# EAGLE design 0101 (EAGLE 9.6.2)
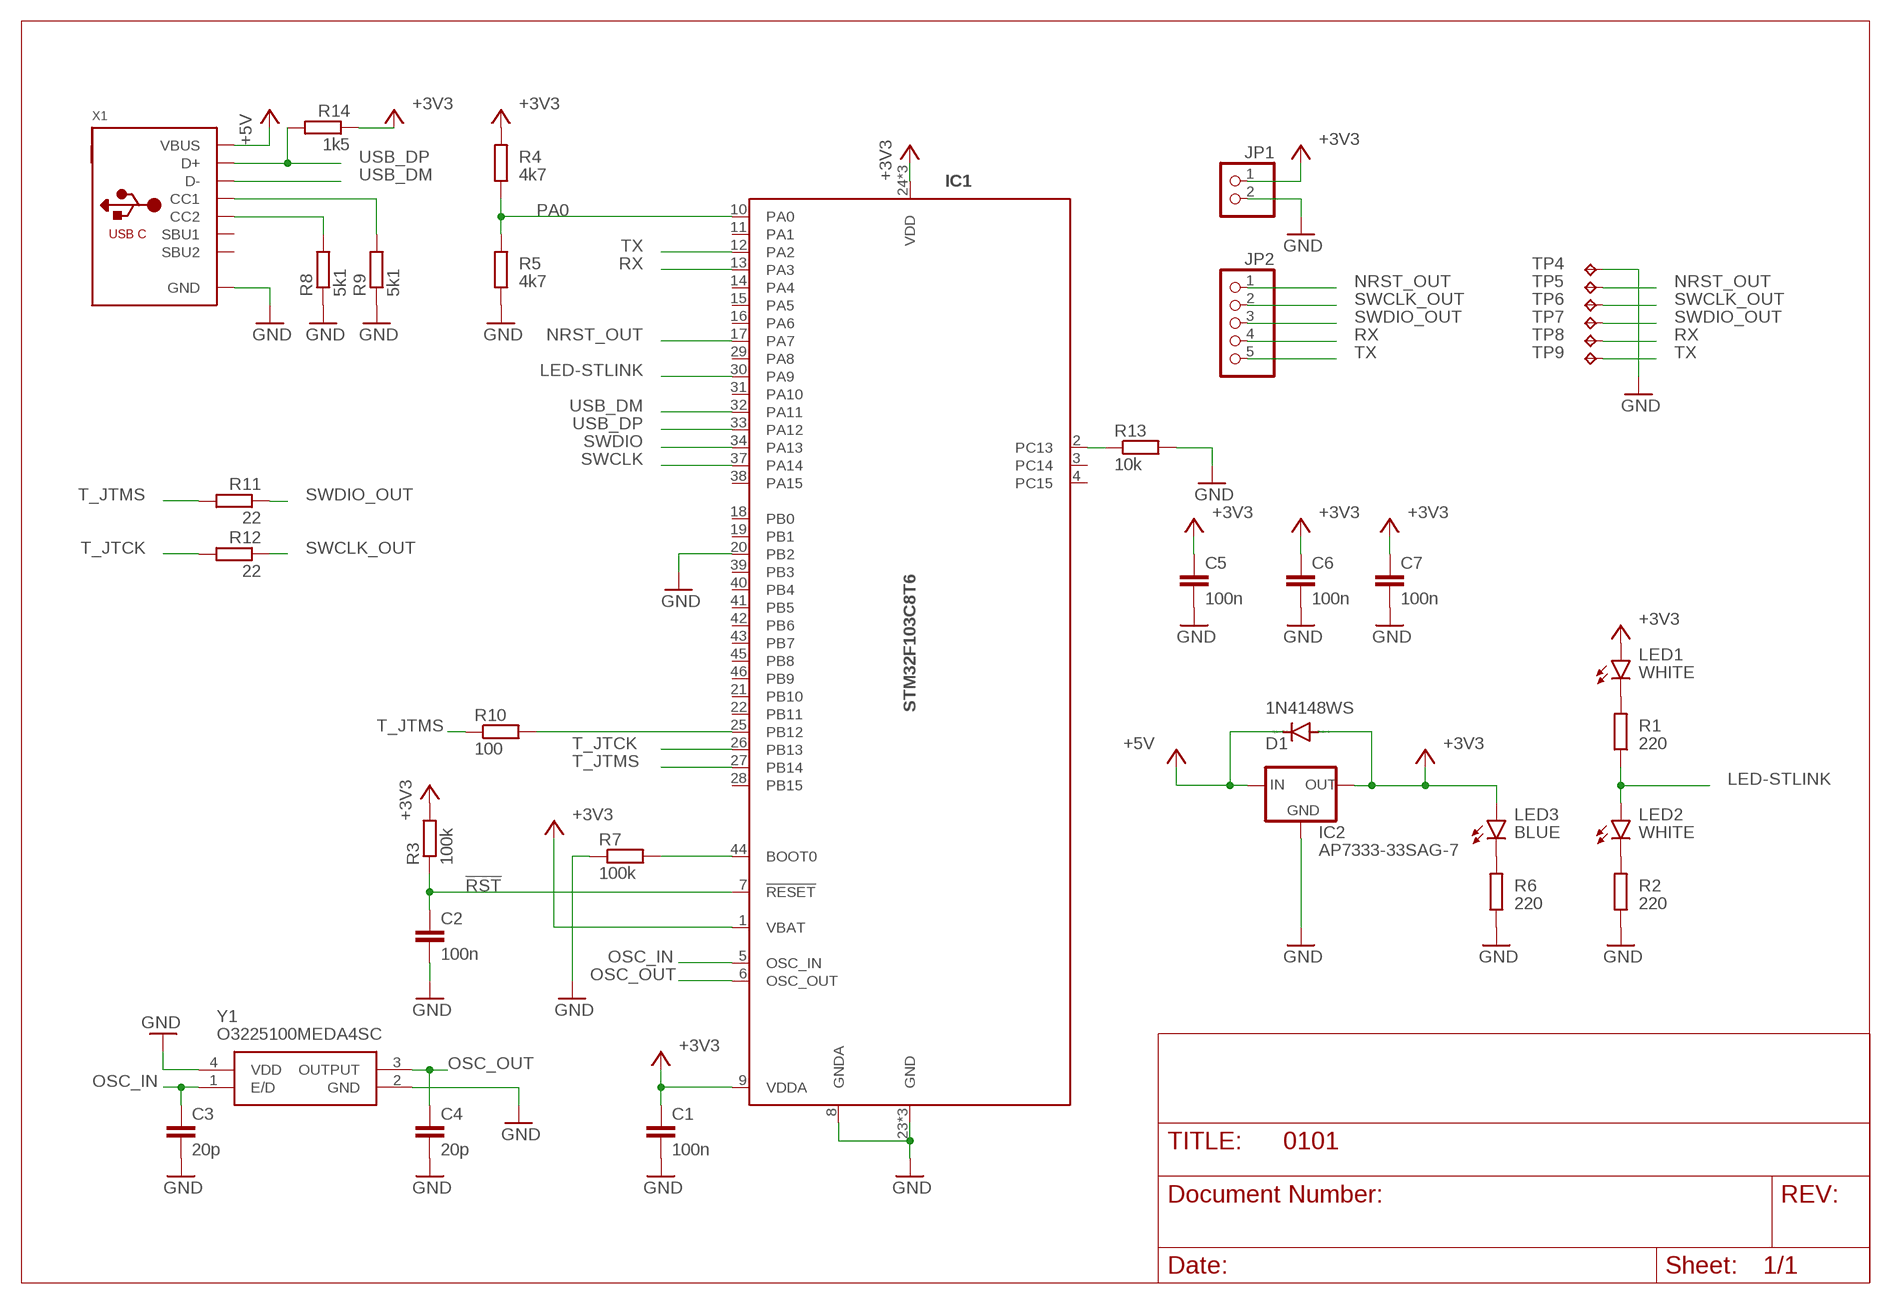
[diagram p0: schematic, sheet 1]

## Parts
C1  100n  C-EUC0402  [C0402]
C2  100n  C-EUC0402  [C0402]
C3  20p  C-EUC0402  [C0402]
C4  20p  C-EUC0402  [C0402]
C5  100n  C-EUC0402  [C0402]
C6  100n  C-EUC0402  [C0402]
C7  100n  C-EUC0402  [C0402]
D1  1N4148WS  DIODE-SOD323-R  [SOD323-R]
IC1  STM32F103C8T6  [QFP48-7X7-0.5]
IC2  AP7333-33SAG-7  XC63FPM  [SOT23]
JP1  PINHD-1X2  [1X02]
JP2  PINHD-1X5  [1X05]
LED1  WHITE  LEDCHIP-LED0603  [CHIP-LED0603]
LED2  WHITE  LEDCHIP-LED0603  [CHIP-LED0603]
LED3  BLUE  LEDCHIP-LED0603  [CHIP-LED0603]
R1  220  R-EU_R0402  [R0402]
R2  220  R-EU_R0402  [R0402]
R3  100k  R-EU_R0402  [R0402]
R4  4k7  R-EU_R0402  [R0402]
R5  4k7  R-EU_R0402  [R0402]
R6  220  R-EU_R0402  [R0402]
R7  100k  R-EU_R0402  [R0402]
R8  5k1  R-EU_R0402  [R0402]
R9  5k1  R-EU_R0402  [R0402]
R10  100  R-EU_R0402  [R0402]
R11  22  R-EU_R0402  [R0402]
R12  22  R-EU_R0402  [R0402]
R13  10k  R-EU_R0402  [R0402]
R14  1k5  R-EU_R0402  [R0402]
TP4  TPTP10SQ  [TP10SQ]
TP5  TPTP10R  [TP10R]
TP6  TPTP10R  [TP10R]
TP7  TPTP10R  [TP10R]
TP8  TPTP10R  [TP10R]
TP9  TPTP10R  [TP10R]
X1  USB_C  [USB_C_CUSB31-CFM2AX-01-X]
Y1  O3225100MEDA4SC  [O3225100MEDA4SC]

## Nets
!RST: C2.1 IC1.7(!RESET) R3.1
+3V3 [PWR]: C1.1 C5.1 C6.1 C7.1 D1.A IC1.1(VBAT) IC1.9(VDDA) IC1.24(VDD) IC1.36(VDD) IC1.48(VDD) IC2.2(OUT) JP1.1 LED1.A LED3.A R3.2 R4.2 R14.1
+5V [PWR]: D1.C IC2.3(IN) X1.A4B9(VBUS) X1.B4A9(VBUS)
GND [PWR]: C1.2 C2.2 C3.2 C4.2 C5.2 C6.2 C7.2 IC1.8(GNDA) IC1.20(PB2) IC1.23(GND) IC1.35(GND) IC1.47(GND) IC2.1(GND) JP1.2 R2.1 R5.1 R6.1 R7.1 R8.1 R9.1 R13.2 TP4.TP X1.A1B12(GND) X1.B1A12(GND) Y1.2(GND) Y1.4(VDD)
LED-STLINK: IC1.30(PA9) LED2.A R1.1
N$1: IC1.2(PC13) R13.1
N$2: LED2.C R2.2
N$3: LED3.C R6.2
N$4: IC1.44(BOOT0) R7.2
N$5: LED1.C R1.2
N$6: R9.2 X1.A5(CC1)
N$7: R8.2 X1.B5(CC2)
N$8: IC1.25(PB12) R10.2
NRST_OUT: IC1.17(PA7) JP2.1 TP5.TP
OSC_IN: C3.1 IC1.5(OSC_IN) Y1.1(E/D)
OSC_OUT: C4.1 IC1.6(OSC_OUT) Y1.3(OUTPUT)
PA0: IC1.10(PA0) R4.1 R5.2
RX: IC1.13(PA3) JP2.4 TP8.TP
SWCLK: IC1.37(PA14)
SWCLK_OUT: JP2.2 R12.1 TP6.TP
SWDIO: IC1.34(PA13)
SWDIO_OUT: JP2.3 R11.1 TP7.TP
T_JTCK: IC1.26(PB13) R12.2
T_JTMS: IC1.27(PB14) R10.1 R11.2
TX: IC1.12(PA2) JP2.5 TP9.TP
USB_DM: IC1.32(PA11) X1.A7(D-) X1.B7(D-)
USB_DP: IC1.33(PA12) R14.2 X1.A6(D+) X1.B6(D+)
Unconnected: IC1.3(PC14) IC1.4(PC15) IC1.11(PA1) IC1.14(PA4) IC1.15(PA5) IC1.16(PA6) IC1.18(PB0) IC1.19(PB1) IC1.21(PB10) IC1.22(PB11) IC1.28(PB15) IC1.29(PA8) IC1.31(PA10) IC1.38(PA15) IC1.39(PB3) IC1.40(PB4) IC1.41(PB5) IC1.42(PB6) IC1.43(PB7) IC1.45(PB8) IC1.46(PB9) X1.A8(SBU1) X1.B8(SBU2)

## Library data of the parts
C1-C7 = rcl:C-EU: CAPACITOR, European symbol; SPICEPREFIX: C
D1 = diode:DIODE-: DIODE
IC1 = STM32F10x:STM32F103C; MF: ST; MPN: STM32F103C8T6
IC2 = v-reg:XC63FP: Positiv Voltage Regulators www.torex.co.jp/english/product/pro02/pdf/0201_xc62fp.pdf
JP1 = pinhead-compact:PINHD-1X2: PIN HEADER
JP2 = pinhead-compact:PINHD-1X5: PIN HEADER
LED1-LED3 = led:LED: LED OSRAM: - CHIPLED LG R971, LG N971, LY N971, LG Q971, LY Q971, LO R971, LY R971 LH N974, LH R974 LS Q976, LO Q976, LY Q976 LO Q996 - Hyper CHIPLED LW Q18S LB Q993, LB Q99A, LB R99A - SideLED LS A670, LO A670, LY A670, LG A670, LP A670 LB A673, LV A673, LT A673, LW A673 LH A674 LY A675 LS A676, LA A676, LO A676, LY A676, LW A676 LS A679, LY A679, LG A679 - Hyper Micro SIDELED® LS Y876, LA Y876, LO Y876, LY Y876 LT Y87S - SmartLED LW L88C, LW L88S LB L89C, LB L89S, LG L890 LS L89K, LO L89K, LY L89K LS L896, LA L896, LO L896, LY L896 - TOPLED LS T670, LO T670, LY T670, LG T670, LP T670 LSG T670, LSP T670, LSY T670, LOP T670, LYG T670 LG T671, LOG T671, LSG T671 LB T673, LV T673, LT T673, LW T673 LH T674 LS T676, LA T676, LO T676, LY T676, LB T676, LH T676, LSB T676, LW T676 LB T67C, LV T67C, LT T67C, LS T67K, LO T67K, LY T67K, LW E67C LS E67B, LA E67B, LO E67B, LY E67B, LB E67C, LV E67C, LT E67C LW T67C LS T679, LY T679, LG T679 LS T770, LO T770, LY T770, LG T770, LP T770 LB T773, LV T773, LT T773, LW T773 LH T774 LS E675, LA E675, LY E675, LS T675 LS T776, LA T776, LO T776, LY T776, LB T776 LHGB T686 LT T68C, LB T68C - Hyper Mini TOPLED® LB M676 - Mini TOPLED Santana® LG M470 LS M47K, LO M47K, LY M47K Source: http://www.osram.convergy.de LUXEON: - LUMILED® LXK2-PW12-R00, LXK2-PW12-S00, LXK2-PW14-U00, LXK2-PW14-V00 LXK2-PM12-R00, LXK2-PM12-S00, LXK2-PM14-U00 LXK2-PE12-Q00, LXK2-PE12-R00, LXK2-PE12-S00, LXK2-PE14-T00, LXK2-PE14-U00 LXK2-PB12-K00, LXK2-PB12-L00, LXK2-PB12-M00, LXK2-PB14-N00, LXK2-PB14-P00, LXK2-PB14-Q00 LXK2-PR12-L00, LXK2-PR12-M00, LXK2-PR14-Q00, LXK2-PR14-R00 LXK2-PD12-Q00, LXK2-PD12-R00, LXK2-PD12-S00 LXK2-PH12-R00, LXK2-PH12-S00 LXK2-PL12-P00, LXK2-PL12-Q00, LXK2-PL12-R00 Source: www.luxeon.com KINGBRIGHT: KA-3528ASYC Source: www.kingbright.com
R1-R14 = rcl:R-EU_: RESISTOR, European symbol; SPICEPREFIX: R
TP4-TP9 = testpad:TP: Test pad
X1 = microbuilder:USB_C: USB Type-C USB 2.0 Connector
Y1 = 7325-0800A2010-00:O3225100MEDA4SC: SMD Oscillators(XO) 100MHz +/-20ppm SMD-3225_4P RoHS Source: Datasheet <https://datasheet.lcsc.com/szlcsc/Yangxing-Tech-O3225100MEDA4SC_C70602.pdf>; DESCRIPTION: SMD Oscillators(XO) 100MHz +/-20ppm SMD-3225_4P RoHS; HEIGHT: 1.1mm; MANUFACTURER_NAME: Yangxing Tech; MANUFACTURER_PART_NUMBER: O3225100MEDA4SC

## Net classes
0 default: width 0.254 mm
1 PWR: width 0.254 mm

## Board
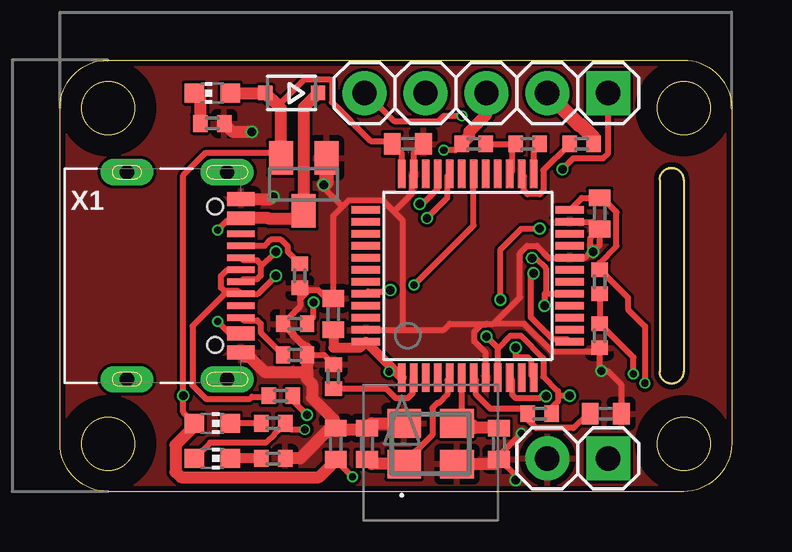
[diagram p1: board, top side]
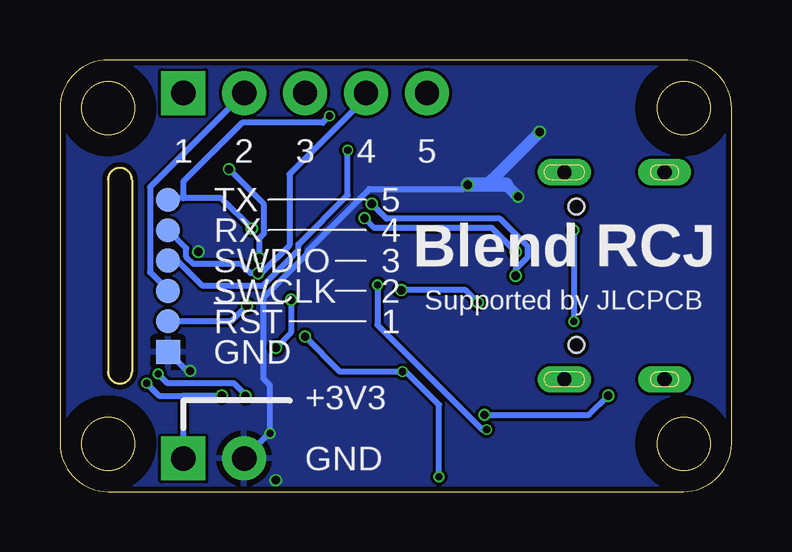
[diagram p2: board, bottom side, seen from below]

Size 28 x 18 mm. Coordinates in mm from the lower left corner, seen from the top.
Outline: 2,18 26,18 arc-90 28,16 28,2 arc-90 26,0 2,0 arc-90 0,2 0,16 arc-90 2,18
Outline: 25,13 25,5 arc180 26,5 26,13 arc180 25,13
Outline: circle at 2,16 radius 1.1
Outline: circle at 2,2 radius 1.1
Outline: circle at 26,2 radius 1.1
Outline: circle at 26,16 radius 1.1
Copper layers (1*16): Top 0.035mm / dielectric 1.6mm / Bottom 0.035mm
Design rules "jlcpcb-2layers": minimum track width 5mil, minimum drill 0.3mm, track to track 5mil, track to pad 5mil, pad to pad 5mil, via to via 5mil, smd to smd 5mil, copper to edge 0.2mm, drill to drill 6mil, minimum pad ring 10mil, minimum via ring 3mil, stop-mask expansion 4mil, vias tented up to drill 0mil, thermal gap 10mil
tRestrict: area 24,0 to 28,4; area 24,14 to 28,18; area 0,0 to 4,4; area 0,14 to 4,18
bRestrict: area 24,14 to 28,18; area 24,0 to 28,4; area 0,0 to 4,4; area 0,14 to 4,18

### Footprints (pad centres in the part's own frame; a part is rotated, then mirrored left to right if it is on the bottom)
C0402 = smd 0.7 x 0.9: 1 -0.65,0; 2 0.65,0
SOD323-R = smd 0.6 x 0.6: A 1.1,0; C -1.1,0
QFP48-7X7-0.5 = smd 1.2 x 0.3: 1 -4.25,2.75; 2 -4.25,2.25; 3 -4.25,1.75; 4 -4.25,1.25; 5 -4.25,0.75; 6 -4.25,0.25; 7 -4.25,-0.25; 8 -4.25,-0.75; 9 -4.25,-1.25; 10 -4.25,-1.75; 11 -4.25,-2.25; 12 -4.25,-2.75; 25 4.25,-2.75; 26 4.25,-2.25; 27 4.25,-1.75; 28 4.25,-1.25; 29 4.25,-0.75; 30 4.25,-0.25; 31 4.25,0.25; 32 4.25,0.75; 33 4.25,1.25; 34 4.25,1.75; 35 4.25,2.25; 36 4.25,2.75 | smd 0.3 x 1.2: 13 -2.75,-4.25; 14 -2.25,-4.25; 15 -1.75,-4.25; 16 -1.25,-4.25; 17 -0.75,-4.25; 18 -0.25,-4.25; 19 0.25,-4.25; 20 0.75,-4.25; 21 1.25,-4.25; 22 1.75,-4.25; 23 2.25,-4.25; 24 2.75,-4.25; 37 2.75,4.25; 38 2.25,4.25; 39 1.75,4.25; 40 1.25,4.25; 41 0.75,4.25; 42 0.25,4.25; 43 -0.25,4.25; 44 -0.75,4.25; 45 -1.25,4.25; 46 -1.75,4.25; 47 -2.25,4.25; 48 -2.75,4.25
SOT23 = smd 1 x 1.4: 1 -0.95,-1.1; 2 0.95,-1.1; 3 0,1.1
1X02 = drill 1.016 square: 1 -1.27,0 | drill 1.016: 2 1.27,0
1X05 = drill 1.016 square: 1 -5.08,0 | drill 1.016: 2 -2.54,0; 3 0,0; 4 2.54,0; 5 5.08,0
CHIP-LED0603 = smd 0.8 x 0.8: A 0,-0.75; C 0,0.75
R0402 = smd 0.6 x 0.7: 1 -0.5,0; 2 0.5,0
TP10SQ = smd 1 x 1: TP 0,0
TP10R = smd 1 x 1: TP 0,0
USB_C_CUSB31-CFM2AX-01-X = smd 0.575 x 1.15: A1B12 -3.2,3.545; A4B9 -2.4,3.545; B1A12 3.2,3.545; B4A9 2.4,3.545 | smd 0.275 x 1.15: A5 -1.25,3.545; A6 -0.25,3.545; A7 0.25,3.545; A8 1.25,3.545; B5 1.75,3.545; B6 0.75,3.545; B7 -0.75,3.545; B8 -1.75,3.545 | drill 0.6 pad 1 long: M1 -4.32,2.97; M2 4.32,2.97; M3 -4.32,-1.21; M4 4.32,-1.21 | hole 0.65: 2.89,2.47; -2.89,2.47
O3225100MEDA4SC = smd 1.4 x 1.2: 1 -1.1,-0.85; 2 1.1,-0.85; 3 1.1,0.85; 4 -1.1,0.85

### Placement (x,y rotation side)
C1  11.5,2 90 top
C2  22.75,3.25 0 top
C3  12.8,2 90 top
C4  18.3,2 270 top
C5  11.4,7.4 90 top
C6  14.5,14.5 0 top
C7  22.5,11.6 270 top
D1  9.66,16.62 180 top
IC1  17,9 90 top
IC2  10.16,12.81 180 top
JP1  21.59,1.38 180 top
JP2  17.78,16.62 180 top
LED1  6.35,2.85 270 top
LED2  6.35,1.38 270 top
LED3  6.35,16.62 90 top
R1  8.89,2.85 180 top
R2  8.89,1.38 180 top
R3  20,3.25 0 top
R4  22.5,8.75 90 top
R5  22.5,6.5 90 top
R6  6.35,15.35 180 top
R7  9.8,7 0 top
R8  9.8,5.7 180 top
R9  10,9 90 top
R10  19.5,14.5 0 top
R11  17.25,14.5 0 top
R12  21.75,14.5 180 top
R13  11.4,4.8 90 top
R14  9.2,4 180 top
TP4  23.5,5.83 90 bottom
TP5  23.5,7.09 90 bottom
TP6  23.5,8.37 90 bottom
TP7  23.5,9.63 90 bottom
TP8  23.5,10.9 90 bottom
TP9  23.5,12.18 90 bottom
X1  4,9 270 top
Y1  15.45,2 0 top

### Tracks (layer width: path | path; a pad name or v marks a point on that pad's centre or on a via)
!RST
  Top 0.254: C2.1 22.01,3.25 21.41,2.65 19.84,2.65 19.5,2.99 R3.1 19.3,3.45 17.94,3.45 17.58,3.81 17.35,4.04 17.35,4.65 IC1.7
+3V3  (via drill 0.3, 0.35)
  Top 0.254: IC1.36 14.25,14.1 C6.1 13.81,14.62 12.95,14.62 11.34,16.24 11.34,17.1 11.24,17.19 10.19,17.19 9.09,16.09 | IC1.24 21.75,12.25 C7.1 22.61,12.25 23.2,11.65 23.2,10.25 22.5,9.54 R4.2 22.57,9.19 23.68,8.09 23.68,7.6 24.39,6.89 v24.39,4.52 | 20.77,4 20.77,4.19 20.15,4.8 20.15,5.56 19.21,6.5 18.79,6.5 18.25,5.96 | 20.77,4 20.77,3.77 20.5,3.5 R3.2 | v21.25,4 20.77,4 | v13.72,5 13.86,5.14 | v12.19,0.62 11.62,1.19 C1.1 | IC1.9 18.25,5.96 | LED1.A 5.14,3.31 v5.14,4 5.14,13.19 6.08,14.13 8.99,14.13 IC2.2 | R14.1 9.7,3.8 v10.3,3.2 | v17.78,6.46 18.25,5.99 18.25,5.96
  Top 0.406: C5.1 11.4,6 12.5,6 IC1.48 13.86,5.14 IC1.1
  Top 0.508: LED3.A D1.A 9.09,16.09 9.21,15.97 IC2.2 | LED1.A 5.6,2.72 4.82,1.94 4.82,0.82 5.04,0.6 10.8,0.6 11.5,1.3 C1.1
  Bottom 0.254: v12.19,0.62 12.19,3.62 13.57,5 v13.72,5 16.32,5 v17.78,6.46 | v10.3,3.2 5.94,3.2 v5.14,4 | JP1.1 22.86,4 v21.25,4 23.87,4 v24.39,4.52
+5V  (via drill 0.3)
  Top 0.254: v6.57,7.09 7.05,6.62 7.53,6.62 X1.B4A9 | v6.57,10.9 6.95,11.29 7.33,11.29 X1.A4B9
  Top 0.508: D1.C 10.16,16.02 IC2.3 9.82,11.37 8.73,11.37 8.7,11.4 X1.A4B9
  Bottom 0.254: v6.57,10.9 6.57,8.43 v6.57,7.09
GND  (via drill 0.3, 0.35)
  Top 0.254: C6.2 14.75,14.1 IC1.35 14.67,13.19 14.67,12.43 13.92,11.69 | IC1.23 22.2,11.25 C7.2 | C7.2 22.1,10.55 22.1,9.99 21.86,9.75 IC1.20 20.38,9.75 19.89,10.24 19.48,10.24 19.18,9.94 19.18,8.1 18.08,7 | R7.1 9.75,7.45 9.75,7.46 10,7.71 10,8 | R9.1 10,8 | R5.1 22.5,5.83 | C2.2 23.4,4.46 22.84,5.03 v22.57,5.03 22.5,5.1 22.5,5.83 | IC1.47 14.28,6.75 | 14.28,6.75 16,6.75 16.25,7 17.8,7 | 10,8 10.07,8.07 10.07,8.1 10.36,8.39 10.78,8.39 11.17,8 11.35,8 C5.2 11.4,11.51 11.78,11.89 | R8.1 11,5.7 R13.2 | 11.78,11.89 12.04,12.15 13.46,12.15 13.92,11.69 | 14.28,6.75 14.28,11.33 13.92,11.69 | v19.24,2.43 18.38,1.57 C4.2 19,0.65 v19,0.48 | 11.78,11.89 11.14,12.52 v11,12.8 | C7.2 22.5,10.27 v22.23,10 | 17.8,7 18.08,7 | 18.08,7 19.35,7 20.51,5.85 22.48,5.85 22.5,5.83 | 17.8,7 17.77,6.96 17.57,6.96 17.27,6.67 17.27,6.25 17.75,5.78 IC1.8
  Top 0.305: R7.1 9.72,6.58 9.72,6.53 9.88,6.37 9.89,6.37 10.3,5.96
  Top 0.508: 11.43,2.58 12.72,2.58 C3.2 13,2.85 Y1.4 | Y1.2 18.1,1.15 C4.2 | 10.3,5.96 R8.1 | R8.1 10.3,4.97 8.56,4.97 7.91,5.62 7.73,5.62 X1.B1A12 | X1.A1B12 8.8,12.2 v8.9,12.3 | v8,15 7.2,15 R6.1 | R8.1 10.3,4.7 10.51,4.49 10.51,3.91 11.43,2.99 11.43,2.58 | 11.43,2.58 C1.2 11.27,2.65 10,1.38 R2.1
  Top 0.61: IC2.1 11.11,12.91 v11,12.8
  Bottom 0.254: v11,12.8 11.18,12.62 15.1,12.62 17.67,10.04 17.67,9.93 19.5,8.09 19.5,4.69 19.24,4.43 v19.24,2.43 19.27,2.43 JP1.2 | TP4.TP 22.7,5.03 v22.57,5.03
  Bottom 0.508: v8.9,12.3 9.4,12.8 | 9.8,12.8 10,13 v8,15
  Bottom 0.61: v11,12.8 9.8,12.8 9.4,12.8
  pour Top: 0,18 28,18 28,0 0,0
  pour Bottom: 0,18 28,18 28,0 0,0
LED-STLINK  (via drill 0.3)
  Top 0.254: v14.76,8.62 17.24,11.1 17.24,13.19 IC1.30 | v10.21,2.58 9.65,2.58 R1.1 8.94,2.4 8.94,2.39 8.58,2.03 6.25,2.03 LED2.A
  Bottom 0.254: v10.21,2.58 10.4,2.58 14.76,6.95 v14.76,8.62
N$1
  Top 0.254: IC1.2 14.71,4.71 14.71,4.1 14.51,3.9 13.99,3.9 13.59,4.3 R13.1
N$2
  Top 0.406: R2.2 LED2.C
N$3
  Top 0.508: LED3.C 5.85,16.37 R6.2
N$4  (via drill 0.35)
  Top 0.254: R7.2 10.57,7.27 v10.57,7.89 | IC1.44 12.85,8.35 13.77,8.35 v13.77,8.4
  Bottom 0.254: v10.57,7.89 11.09,8.4 v13.77,8.4
N$5
  Top 0.254: R1.2 LED1.C
N$6
  Top 0.254: R9.2 9.51,9.99 9.51,10.21 9.21,10.5 8.79,10.5 8.54,10.25 X1.A5
N$7
  Top 0.254: X1.B5 7.65,7.14 8.22,7.14 8.37,6.99 8.37,6.63 R8.2
N$8
  Top 0.254: IC1.25 19.75,14.25 R10.2
NRST_OUT  (via drill 0.35)
  Top 0.254: v19.68,9.73 19.83,9.73 20.25,9.31 20.25,8.3 20.2,8.25 | v20.95,13.45 21.41,13.9 22.66,13.9 22.86,14.1 JP2.1 | IC1.17 20.2,8.25 | 20.2,8.25 v20.2,7.75
  Bottom 0.254: v19.68,9.73 19.68,10.57 19.5,10.76 19.5,11.98 v20.95,13.45 | v20.2,7.75 20.86,7.09 TP5.TP
OSC_IN
  Top 0.254: IC1.5 16.15,4.65 16.15,4.04 15.81,3.7 15.74,3.7 15.53,3.49 15.53,2.37 14.35,1.19 Y1.1
  Top 0.508: Y1.1 13,1.15 C3.1
OSC_OUT
  Top 0.254: 16.82,3.12 Y1.3 16.75,2.65 | 16.98,2.97 16.82,3.12 | 16.82,3.12 16.75,3.2 IC1.6
  Top 0.508: C4.1 17.3,2.65 | 17.3,2.65 16.75,2.65 | 17.3,2.65 16.98,2.97
PA0  (via drill 0.3, 0.35)
  Top 0.254: IC1.10 18.85,4.65 18.85,4.04 19,3.9 20,3.9 20.09,3.98 v20.26,3.98 | R4.1 R5.2 22.88,6.62 22.89,6.62 23.91,5.6 v23.91,4.9
  Bottom 0.254: v23.91,4.9 23.53,4.52 20.77,4.52 20.29,4.05 v20.26,3.98
RX  (via drill 0.35)
  Top 0.254: IC1.13 21.15,6.35 20.55,6.35 19.62,7.27 19.62,8.98 v19.75,9.11
  Bottom 0.254: JP2.4 15.24,16.43 18.43,13.23 18.43,10.27 19.58,9.13 19.72,9.13 v19.75,9.11 20.05,9.11 20.44,9.49 22.44,9.49 22.73,9.79 22.73,10.14 TP8.TP
SWCLK_OUT
  Top 0.254: R12.1 22.25,14.77
  Top 0.61: JP2.2 21.66,15.28 21.73,15.28 22.25,14.77
  Bottom 0.254: TP6.TP 23.5,8.4 24.25,9.15 24.25,12.69 JP2.2
SWDIO_OUT  (via drill 0.3)
  Top 0.254: v16,14.24 16.48,14.24 16.57,14.33 R11.1
  Top 0.508: R11.1 17.07,14.82 17.07,15.01 17.78,15.72 JP2.3
  Bottom 0.254: TP7.TP 23.12,9.63 22.08,8.6 19.54,8.6 18.05,10.08 18.05,10.31 16,12.36 v16,14.24
T_JTCK
  Top 0.254: R12.2 20.15,13.4 20.15,12.54 20,12.4 19.5,12.4 19.35,12.54 19.35,13.15 IC1.26
T_JTMS
  Top 0.254: IC1.27 18.85,13.35 18.85,14.5 R10.1 R11.2
TX  (via drill 0.3, 0.35)
  Top 0.254: v16.76,15.67 16,15.67 15.79,15.45 13.93,15.45 12.76,16.62 JP2.5 | IC1.12 19.65,4.85 19.65,5.46 19.5,5.6 19,5.6 v19,6 | v18.36,8 18.36,10.09 19.24,10.97 v20,10.97
  Bottom 0.254: v16.76,15.67 17.05,15.38 20.4,15.38 22.86,12.92 22.86,12.24 | TP9.TP 23.43,12.24 22.86,12.24 | v19,6 18.36,6.63 v18.36,8 | v20,10.97 21.27,12.24 22.86,12.24
USB_DM  (via drill 0.35)
  Top 0.254: X1.A7 7.65,8.86 8.22,8.86 8.37,9.01 8.37,9.37 | 8.37,9.37 8.37,9.49 8.22,9.64 7.65,9.64 X1.B7 | 8.37,9.37 v9,10 | IC1.32 16.15,13.15 16.15,12.26 v15.3,11.4
  Bottom 0.254: v9,10 10,11 14.9,11 v15.3,11.4
USB_DP  (via drill 0.35)
  Top 0.254: 6.87,8.36 6.72,8.51 6.72,8.99 6.96,9.24 7.54,9.24 X1.A6 | 6.87,8.36 7.44,8.36 X1.B6 8.25,8.25 v9,9 | v15,12 15.11,12 15.75,12.64 IC1.33 | R14.2 8.67,3.95 8,3.95 7.91,3.86 6.1,3.86 5.52,4.43 5.52,6.9 6.86,8.24 6.87,8.36
  Bottom 0.254: v15,12 14.38,11.38 9.67,11.38 8.49,10.21 8.49,9.79 9,9.29 v9,9

### Text on the board
bPlace: 5 | 4 | 3 | 2 | 1 | 5 | TX | 4 | RX | Blend RCJ | 3 | SWDIO | Supported by JLCPCB | 2 | SWCLK | 1 | !RST | GND | +3V3 | GND